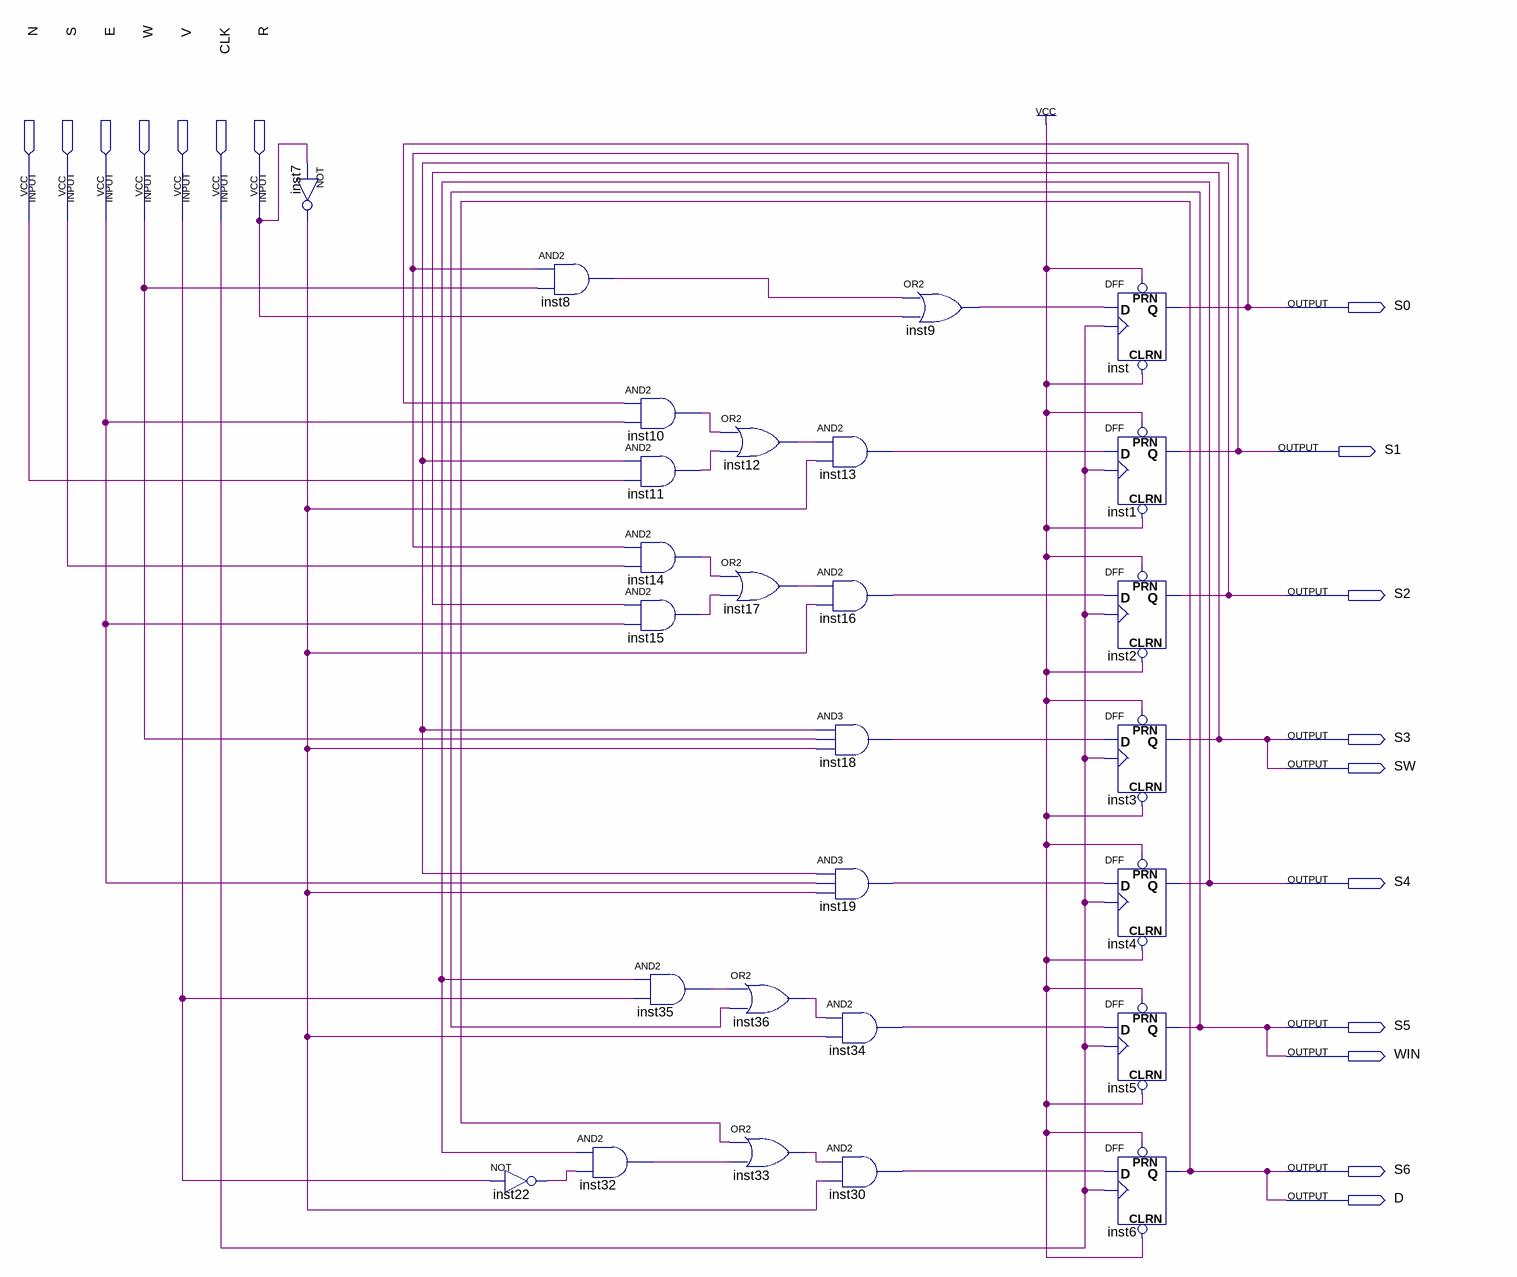
[diagram p0: schematic sheet]
// Quartus schematic ROOM_FSM.bdf as structural Verilog: 27 symbols, 17 pins
module ROOM_FSM (
  input  N,
  input  S,
  input  E,
  input  W,
  input  V,
  input  CLK,
  input  R,
  output S0,
  output S1,
  output S2,
  output S3,
  output SW,
  output S4,
  output S5,
  output WIN,
  output S6,
  output D
);

  wire inst7_out, inst8_out, inst9_out, inst10_out, inst11_out, inst12_out, inst13_out, inst14_out,
       inst15_out, inst16_out, inst17_out, inst18_out, inst19_out, inst22_out, inst30_out, inst32_out,
       inst33_out, inst34_out, inst35_out, inst36_out;

  not inst7 (inst7_out, R);
  and inst8 (inst8_out, S1, W);
  not inst22 (inst22_out, V);
  and inst10 (inst10_out, S0, E);
  and inst11 (inst11_out, S2, N);
  and inst14 (inst14_out, S1, S);
  and inst15 (inst15_out, S3, E);
  and inst32 (inst32_out, S4, inst22_out);
  and inst35 (inst35_out, S4, V);
  or inst12 (inst12_out, inst10_out, inst11_out);
  or inst17 (inst17_out, inst14_out, inst15_out);
  or inst36 (inst36_out, inst35_out, S5);
  or inst33 (inst33_out, D, inst32_out);
  and inst13 (inst13_out, inst12_out, inst7_out);
  and inst16 (inst16_out, inst17_out, inst7_out);
  and inst18 (inst18_out, S2, W, inst7_out);
  and inst19 (inst19_out, S2, E, inst7_out);
  and inst34 (inst34_out, inst36_out, inst7_out);
  and inst30 (inst30_out, inst33_out, inst7_out);
  or inst9 (inst9_out, inst8_out, R);
  DFF inst (.CLRN(1'b1), .CLK(CLK), .D(inst9_out), .PRN(1'b1), .Q(S0));
  DFF inst1 (.CLRN(1'b1), .CLK(CLK), .D(inst13_out), .PRN(1'b1), .Q(S1));
  DFF inst2 (.CLRN(1'b1), .CLK(CLK), .D(inst16_out), .PRN(1'b1), .Q(S2));
  DFF inst3 (.CLRN(1'b1), .CLK(CLK), .D(inst18_out), .PRN(1'b1), .Q(S3));
  DFF inst4 (.CLRN(1'b1), .CLK(CLK), .D(inst19_out), .PRN(1'b1), .Q(S4));
  DFF inst5 (.CLRN(1'b1), .CLK(CLK), .D(inst34_out), .PRN(1'b1), .Q(S5));
  DFF inst6 (.CLRN(1'b1), .CLK(CLK), .D(inst30_out), .PRN(1'b1), .Q(D));

  assign S6 = D;
  assign SW = S3;
  assign WIN = S5;
endmodule
